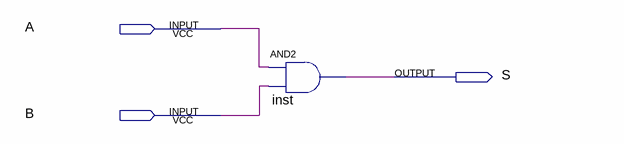
[diagram p0: schematic sheet]
// Quartus schematic AULA10703.bdf as structural Verilog: 1 symbols, 3 pins
module AULA10703 (
  input  A,
  input  B,
  output S
);

  and inst (S, A, B);
endmodule
